# EAGLE schematic qe (EAGLE 6.4)
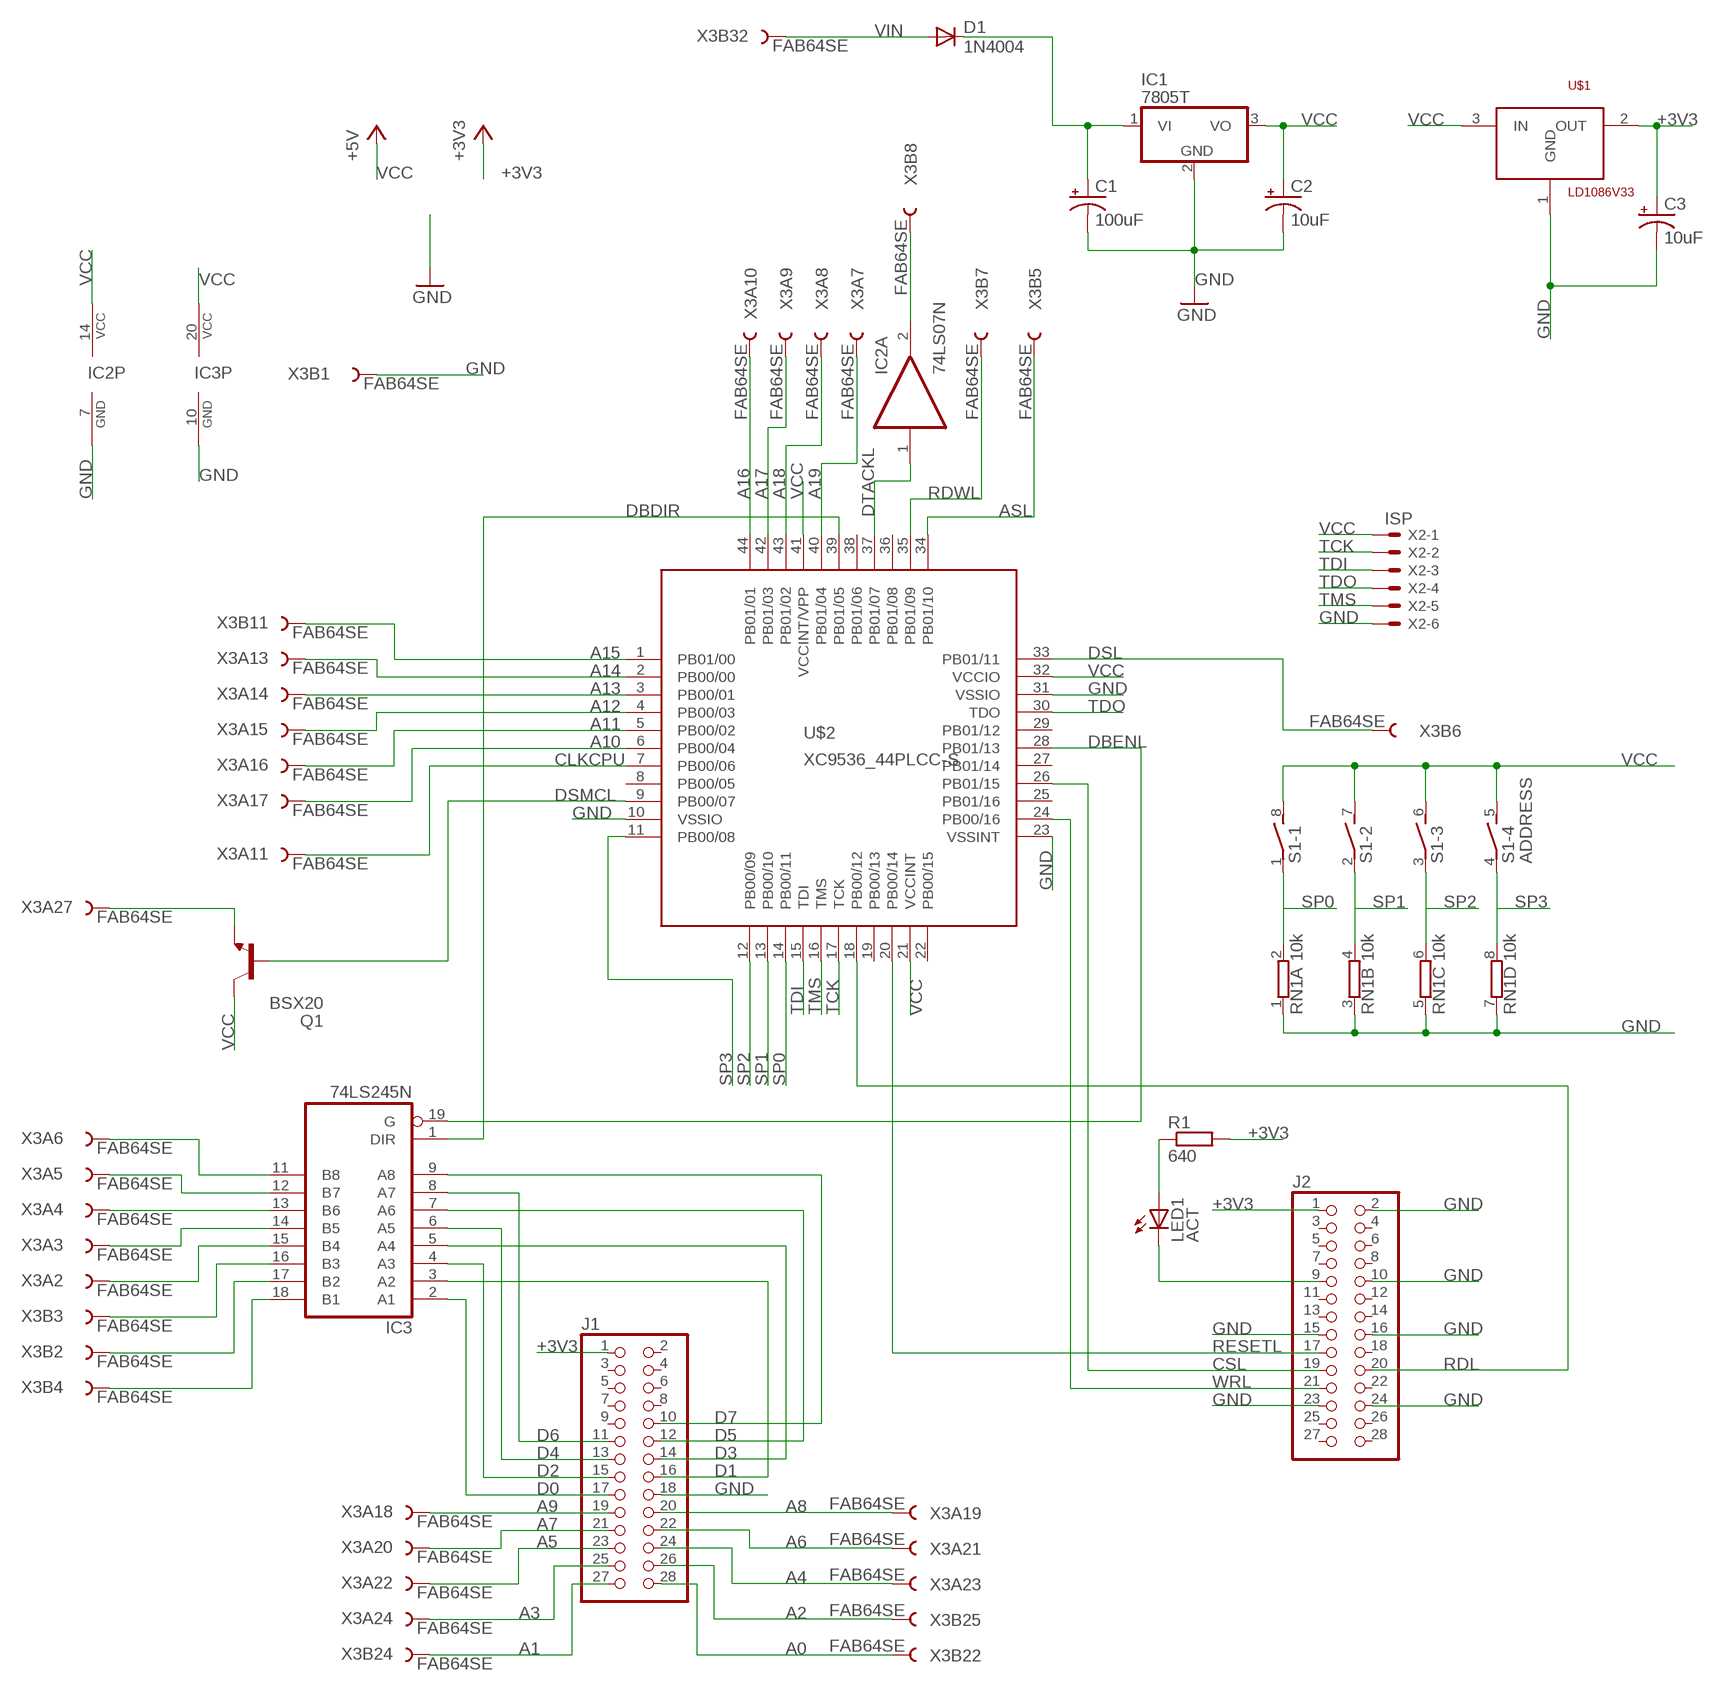
[diagram p0: schematic, sheet 1]

## Parts
C1  100uF  CPOL-USTAP5-80  [TAP5-80]
C2  10uF  CPOL-USTAP5-45  [TAP5-45]
C3  10uF  CPOL-USTAP5-45  [TAP5-45]
D1  1N4004  [DO41-10]
IC1  7805T  [TO220H]
IC2  74LS07N  [DIL14]
IC3  74LS245N  [DIL20]
J1  PINHD-2X14  [2X14]
J2  PINHD-2X14  [2X14]
LED1  ACT  LED5MM  [LED5MM]
Q1  BSX20  [TO18]
R1  640  R-EU_0204/7  [0204/7]
RN1  10k  E4R  [SIL8]
S1  ADDRESS  DIP04S  [DIP04S]
U$1  LD1086V33  [TO220]
U$2  XC9536_44PLCC-S  [PLCC44-S]
X2  ISP  22-23-2061  [22-23-2061]
X3  FAB64SE  [FAB64S]

## Nets
+3V3: C3.+ J1.1 J2.1 R1.2 U$1.2(OUT)
A0: J1.28 X3.B22
A1: J1.27 X3.B24
A2: J1.26 X3.B25
A3: J1.25 X3.A24
A4: J1.24 X3.A23
A5: J1.23 X3.A22
A6: J1.22 X3.A21
A7: J1.21 X3.A20
A8: J1.20 X3.A19
A9: J1.19 X3.A18
A10: U$2.6(PB00/04) X3.A17
A11: U$2.5(PB00/02) X3.A16
A12: U$2.4(PB00/03) X3.A15
A13: U$2.3(PB00/01) X3.A14
A14: U$2.2(PB00/00) X3.A13
A15: U$2.1(PB01/00) X3.B11
A16: U$2.44(PB01/01) X3.A10
A17: U$2.42(PB01/03) X3.A9
A18: U$2.43(PB01/02) X3.A8
A19: U$2.40(PB01/04) X3.A7
ASL: U$2.34(PB01/10) X3.B5
CLKCPU: U$2.7(PB00/06) X3.A11
CSL: J2.19 U$2.26(PB01/15)
D0: IC3.2(A1) J1.17
D1: IC3.3(A2) J1.16
D2: IC3.4(A3) J1.15
D3: IC3.5(A4) J1.14
D4: IC3.6(A5) J1.13
D5: IC3.7(A6) J1.12
D6: IC3.8(A7) J1.11
D7: IC3.9(A8) J1.10
DBDIR: IC3.1(DIR) U$2.39(PB01/05)
DBENL: IC3.19(G) U$2.28(PB01/13)
DSL: U$2.33(PB01/11) X3.B6
DSMCL: Q1.2(B) U$2.9(PB00/07)
DTACKL: IC2.1(A:I) U$2.37(PB01/07)
GND: C1.- C2.- C3.- IC1.2(GND) IC2.7(P:GND) IC3.10(GND) J1.18 J2.2 J2.10 J2.15 J2.16 J2.23 J2.24 RN1.1 RN1.3 RN1.5 RN1.7 U$1.1(GND) U$2.10(VSSIO) U$2.23(VSSINT) U$2.31(VSSIO) X2.6 X3.B1
N$1: IC3.11(B8) X3.A6
N$2: IC3.12(B7) X3.A5
N$3: IC3.13(B6) X3.A4
N$4: IC3.14(B5) X3.A3
N$5: IC3.15(B4) X3.A2
N$6: IC3.16(B3) X3.B3
N$7: IC3.17(B2) X3.B2
N$8: IC3.18(B1) X3.B4
N$9: Q1.1(E) X3.A27
N$10: J2.9 LED1.K(C)
N$11: LED1.A R1.1
N$12: D1.A X3.B32
N$40: IC2.2(A:O) X3.B8
RDL: J2.20 U$2.18(PB00/12)
RDWL: U$2.35(PB01/09) X3.B7
RESETL: J2.17 U$2.20(PB00/14)
SP0: RN1.2 S1.1 U$2.14(PB00/11)
SP1: RN1.4 S1.2 U$2.13(PB00/10)
SP2: RN1.6 S1.3 U$2.12(PB00/09)
SP3: RN1.8 S1.4 U$2.11(PB00/08)
TCK: U$2.17(TCK) X2.2
TDI: U$2.15(TDI) X2.3
TDO: U$2.30(TDO) X2.4
TMS: U$2.16(TMS) X2.5
VCC: C2.+ IC1.3(VO) IC2.14(P:VCC) IC3.20(VCC) Q1.3(C) S1.5 S1.6 S1.7 S1.8 U$1.3(IN) U$2.21(VCCINT) U$2.32(VCCIO) U$2.41(VCCINT/VPP) X2.1 ; supply symbol labelled +5V
VIN: C1.+ D1.C IC1.1(VI)
WRL: J2.21 U$2.24(PB00/16)
Unconnected: IC2.3(B:I) IC2.4(B:O) IC2.5(C:I) IC2.6(C:O) IC2.8(D:O) IC2.9(D:I) IC2.10(E:O) IC2.11(E:I) IC2.12(F:O) IC2.13(F:I) J1.2 J1.3 J1.4 J1.5 J1.6 J1.7 J1.8 J1.9 J2.3 J2.4 J2.5 J2.6 J2.7 J2.8 J2.11 J2.12 J2.13 J2.14 J2.18 J2.22 J2.25 J2.26 J2.27 J2.28 U$2.8(PB00/05) U$2.19(PB00/13) U$2.22(PB00/15) U$2.25(PB01/16) U$2.27(PB01/14) U$2.29(PB01/12) U$2.36(PB01/08) U$2.38(PB01/06) X3.A1 X3.A12 X3.A25 X3.A26 X3.A28 X3.A29 X3.A30 X3.A31 X3.A32 X3.B9 X3.B10 X3.B12 X3.B13 X3.B14 X3.B15 X3.B16 X3.B17 X3.B18 X3.B19 X3.B20 X3.B21 X3.B23 X3.B26 X3.B27 X3.B28 X3.B29 X3.B30 X3.B31

## Library data of the parts
C1-C3 = rcl:CPOL-US: POLARIZED CAPACITOR, American symbol
D1 = diode:1N4004: DIODE general purpose rectifier, 1 A
IC1 = linear:78*: Positive VOLTAGE REGULATOR Source: http://cache.national.com/ds/LM/LM78L05.pdf http://www.fairchildsemi.com/ds/LM/LM7805.pdf
IC2 = 74xx-us:74*07: Hex BUFFER, open collector high-voltage output
IC3 = 74xx-us:74*245: Octal BUS TRANSCEIVER, 3-state
J1 J2 = pinhead:PINHD-2X14: PIN HEADER
LED1 = led:LED: LED OSRAM: - CHIPLED LG R971, LG N971, LY N971, LG Q971, LY Q971, LO R971, LY R971 LH N974, LH R974 LS Q976, LO Q976, LY Q976 LO Q996 - Hyper CHIPLED LW Q18S LB Q993, LB Q99A, LB R99A - SideLED LS A670, LO A670, LY A670, LG A670, LP A670 LB A673, LV A673, LT A673, LW A673 LH A674 LY A675 LS A676, LA A676, LO A676, LY A676, LW A676 LS A679, LY A679, LG A679 - Hyper Micro SIDELED® LS Y876, LA Y876, LO Y876, LY Y876 LT Y87S - SmartLED LW L88C, LW L88S LB L89C, LB L89S, LG L890 LS L89K, LO L89K, LY L89K LS L896, LA L896, LO L896, LY L896 - TOPLED LS T670, LO T670, LY T670, LG T670, LP T670 LSG T670, LSP T670, LSY T670, LOP T670, LYG T670 LG T671, LOG T671, LSG T671 LB T673, LV T673, LT T673, LW T673 LH T674 LS T676, LA T676, LO T676, LY T676, LB T676, LH T676, LSB T676, LW T676 LB T67C, LV T67C, LT T67C, LS T67K, LO T67K, LY T67K, LW E67C LS E67B, LA E67B, LO E67B, LY E67B, LB E67C, LV E67C, LT E67C LW T67C LS T679, LY T679, LG T679 LS T770, LO T770, LY T770, LG T770, LP T770 LB T773, LV T773, LT T773, LW T773 LH T774 LS E675, LA E675, LY E675, LS T675 LS T776, LA T776, LO T776, LY T776, LB T776 LHGB T686 LT T68C, LB T68C - Hyper Mini TOPLED® LB M676 - Mini TOPLED Santana® LG M470 LS M47K, LO M47K, LY M47K Source: http://www.osram.convergy.de LUXEON: - LUMILED® LXK2-PW12-R00, LXK2-PW12-S00, LXK2-PW14-U00, LXK2-PW14-V00 LXK2-PM12-R00, LXK2-PM12-S00, LXK2-PM14-U00 LXK2-PE12-Q00, LXK2-PE12-R00, LXK2-PE12-S00, LXK2-PE14-T00, LXK2-PE14-U00 LXK2-PB12-K00, LXK2-PB12-L00, LXK2-PB12-M00, LXK2-PB14-N00, LXK2-PB14-P00, LXK2-PB14-Q00 LXK2-PR12-L00, LXK2-PR12-M00, LXK2-PR14-Q00, LXK2-PR14-R00 LXK2-PD12-Q00, LXK2-PD12-R00, LXK2-PD12-S00 LXK2-PH12-R00, LXK2-PH12-S00 LXK2-PL12-P00, LXK2-PL12-Q00, LXK2-PL12-R00 Source: www.luxeon.com KINGBRIGHT: KA-3528ASYC Source: www.kingbright.com
Q1 = transistor-npn:BSX20*: NPN Transistor
R1 = resistor:R-EU_: RESISTOR, European symbol
RN1 = resistor-sil:E4R: SIL RESISTOR
S1 = switch-dil:DIP04S: DIL/CODE SWITCH
U$1 = ppe:LD1086V33
U$2 = xilinx-xc9-ppe:XC9536_44PLCC-S
X2 = con-molex:22-23-2061: .100" (2.54mm) Center Header - 6 Pin
X3 = con-vg:FAB64SE: CONNECTOR female, 64 pins, single, type B, rows AB, grid 2.54 mm